# Altium schematic sheet Peripherals.SchDoc
size A4; SheetNumber: 8; SheetTotal: 8
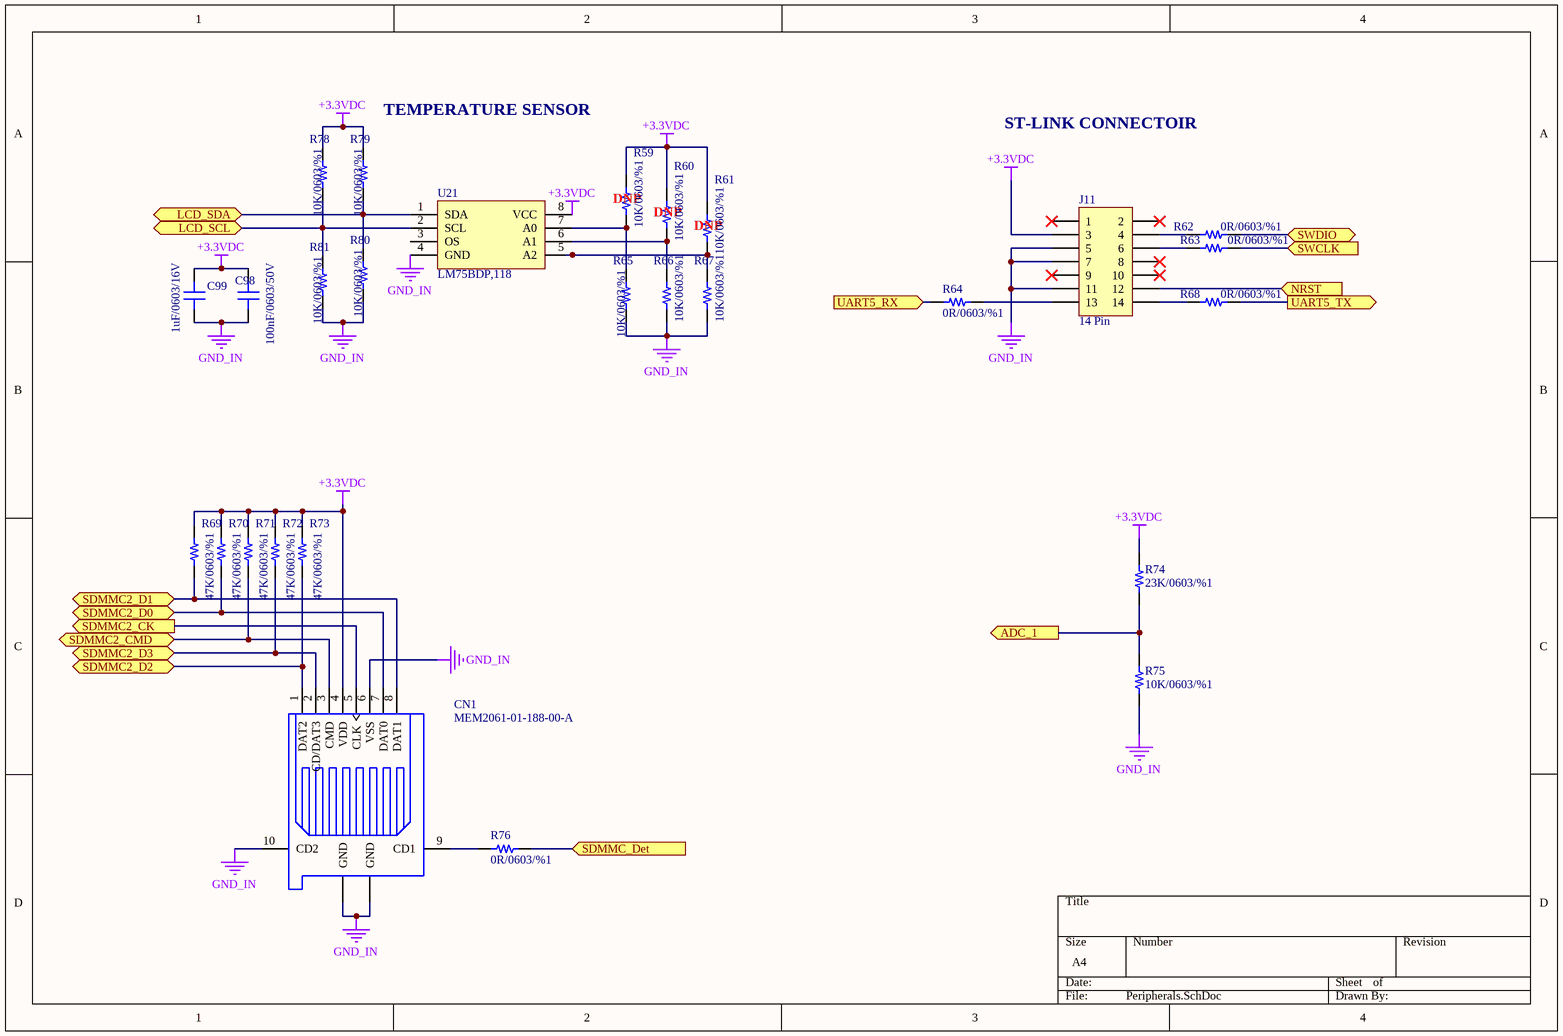
[diagram p0: Peripherals.SchDoc]

## Parts
C98  100nF/0603/50V  [0603_cap]
C99  1uF/0603/16V  [0603_cap]
CN1  MEM2061-01-188-00-A  [GCT_MEM2061-01-188-00-A_REVA]
J11  14 Pin  [L-KLS1-202C-14-S-B]
R59  10K/0603/%1  Assembly: DNP  [0603_res]
R60  10K/0603/%1  Assembly: DNP  [0603_res]
R61  10K/0603/%1  Assembly: DNP  [0603_res]
R62  0R/0603/%1  [0603_res]
R63  0R/0603/%1  [0603_res]
R64  0R/0603/%1  [0603_res]
R65  10K/0603/%1  [0603_res]
R66  10K/0603/%1  [0603_res]
R67  10K/0603/%1  [0603_res]
R68  0R/0603/%1  [0603_res]
R69  47K/0603/%1  [0603_res]
R70  47K/0603/%1  [0603_res]
R71  47K/0603/%1  [0603_res]
R72  47K/0603/%1  [0603_res]
R73  47K/0603/%1  [0603_res]
R74  23K/0603/%1  [0603_res]
R75  10K/0603/%1  [0603_res]
R76  0R/0603/%1  [0603_res]
R78  10K/0603/%1  [0603_res]
R79  10K/0603/%1  [0603_res]
R80  10K/0603/%1  [0603_res]
R81  10K/0603/%1  [0603_res]
U21  LM75BDP,118  [8-tssop]

## Ports
ADC_1 (out, see Main[6C], MCU[3B]), LCD_SCL (bidir, see Main[6C], LCD[1B], MCU[1A]), LCD_SDA (bidir, see Main[6C], LCD[1B], MCU[1A]), NRST (in, see Main[6C], MCU[7A]), SDMMC2_CK (out, see Main[6C], MCU[7A]), SDMMC2_CMD (bidir, see Main[6C], MCU[7A]), SDMMC2_D0 (bidir, see Main[6C], MCU[7A]), SDMMC2_D1 (bidir, see Main[6C], MCU[7A]), SDMMC2_D2 (bidir, see Main[6C], MCU[7A]), SDMMC2_D3 (bidir, see Main[6C], MCU[7A]), SDMMC_Det (in, see Main[6C], MCU[7A]), SWCLK (in, see Main[6C], MCU[7A]), SWDIO (bidir, see Main[6C], MCU[7A]), UART5_RX (in, see Main[6C], MCU[7A]), UART5_TX (out, see Main[6C], MCU[7A])

## Nets
+3.3VDC: C98.1 C99.2 CN1.4(VDD) J11.3 R59.1 R60.1 R61.1 R69.1 R70.1 R71.1 R72.1 R73.1 R74.1 R78.2 R79.2 U21.8(VCC)
GND_IN: C98.2 C99.1 CN1.6(VSS) CN1.10(CD2) CN1.11(GND) CN1.12(GND) J11.5 J11.7 J11.11 R65.1 R66.2 R67.2 R75.2 R80.1 R81.1 U21.4(GND)
ADC_1: R74.2 R75.1 ; port ADC_1
LCD_SCL: R78.1 R81.2 U21.2(SCL) ; port LCD_SCL
LCD_SDA: R79.1 R80.2 U21.1(SDA) ; port LCD_SDA
NRST: J11.12 ; port NRST
SDMMC2_CK: CN1.5(CLK) ; port SDMMC2_CK
SDMMC2_CMD: CN1.3(CMD) R71.2 ; port SDMMC2_CMD
SDMMC2_D0: CN1.7(DAT0) R70.2 ; port SDMMC2_D0
SDMMC2_D1: CN1.8(DAT1) R69.2 ; port SDMMC2_D1
SDMMC2_D2: CN1.1(DAT2) R73.2 ; port SDMMC2_D2
SDMMC2_D3: CN1.2(CD/DAT3) R72.2 ; port SDMMC2_D3
SDMMC_Det: R76.1 ; port SDMMC_Det
SWCLK: R63.1 ; port SWCLK
SWDIO: R62.1 ; port SWDIO
UART5_RX: R64.2 ; port UART5_RX
UART5_TX: R68.1 ; port UART5_TX
NetCN1_9: CN1.9(CD1) R76.2
NetJ11_4: J11.4 R62.2
NetJ11_6: J11.6 R63.2
NetJ11_13: J11.13 R64.1
NetJ11_14: J11.14 R68.2
NetR59_2: R59.2 R65.2 U21.7(A0)
NetR60_2: R60.2 R66.1 U21.6(A1)
NetR61_2: R61.2 R67.1 U21.5(A2)

Not connected (* = marked no-connect by the designer): J11 1* 2* 8* 9* 10*; U21 3(OS)

## Notes on the sheet
- (near R79) TEMPERATURE SENSOR
- ST-LINK CONNECTOIR

## Library data of the parts
C98 C99 = Capacitor: HelpURL: *; PN: *; Assembly: *
  C98: Value: 100nF/0603/50V
  C99: Value: 1uF/0603/16V
CN1 = MEM2061-01-188-00-A: 10 (8 + 2) Position Card Connector Secure Digital - microSD™ Surface Mount, Right Angle Gold; Assembly: .; Value: MEM2061-01-188-00-A; PN: MEM2061-01-188-00-A; HelpURL: https://www.digikey.com/en/products/detail/gct/MEM2061-01-188-00-A/9859612?s=N4IgTCBcDaILIFE5gAwDYCMBaF2MA58cUsBBEAXQF8g
R59-R61 = RES: HelpURL: *; PN: *; Value: 10K/0603/%1
R62-R76 R78-R81 = RES: Assembly: .; HelpURL: *; PN: *
  R62-R64 R68 R76: Value: 0R/0603/%1
  R65-R67 R75 R78-R81: Value: 10K/0603/%1
  R69-R73: Value: 47K/0603/%1
  R74: Value: 23K/0603/%1
U21 = LM75BDP,118: SENSOR DIGITAL -55C-125C 8TSSOP; Assembly: .; HelpURL: https://www.digikey.com/en/products/detail/nxp-usa-inc/LM75BDP-118/2075977; PN: LM75BDP,118; Value: LM75BDP,118
J11 = 14 Pin: Value: *; PN: *; HelpURL: *; Assembly: *